# Altium schematic sheet Sheet2.SchDoc
size A4; SheetNumber: 2; SheetTotal: 2
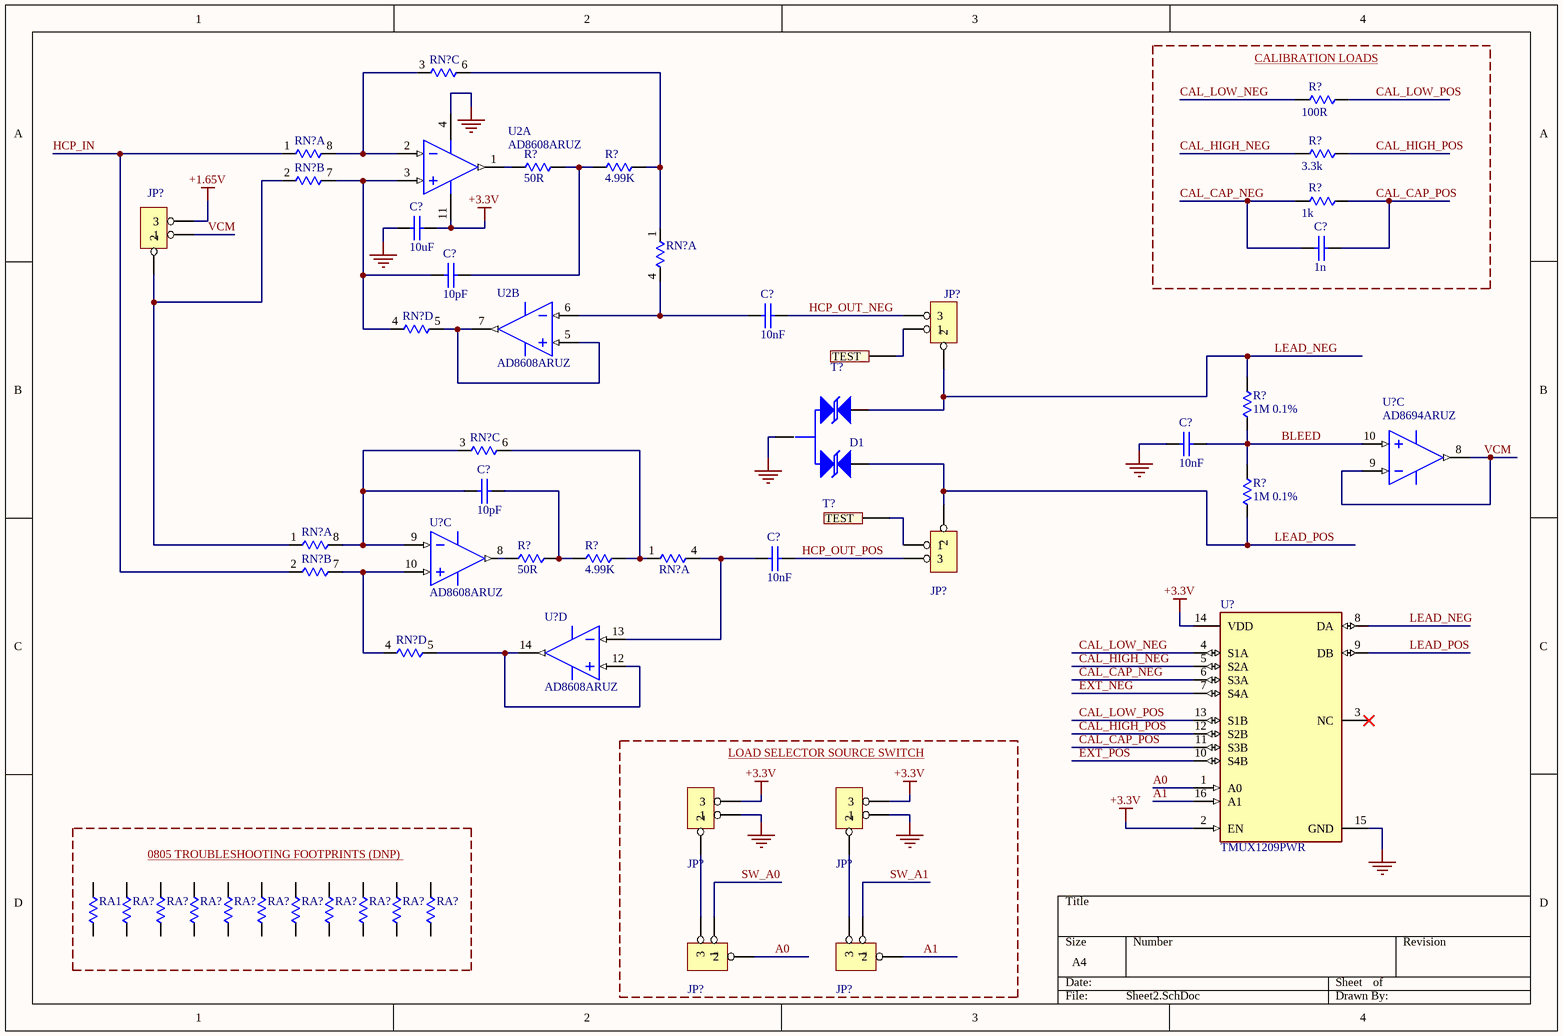
[diagram p0: Sheet2.SchDoc]

## Parts
(Parts that share a designator on the sheet are numbered #1, #2 ... from top to bottom, then left to right.)
C?#1  10uF  [0805-CAP]
C?#2  1n  [0805-CAP]
C?#3  10pF  [0603-CAP]
C?#4  10nF  [0603-CAP]
C?#5  10nF  [0603-CAP]
C?#6  10pF  [0603-CAP]
C?#7  10nF  [0603-CAP]
D1  RCLAMP04022S.C  [SOT-23 3L]  (value not drawn)
JP?#1  JUMPER1X3  [JUMPER3]  (value not drawn)
JP?#2  JUMPER1X3  [JUMPER3]  (value not drawn)
JP?#3  JUMPER1X3  [JUMPER3]  (value not drawn)
JP?#4  JUMPER1X3  [JUMPER3]  (value not drawn)
JP?#5  JUMPER1X3  [JUMPER3]  (value not drawn)
JP?#6  JUMPER1X3  [JUMPER3]  (value not drawn)
JP?#7  JUMPER1X3  [JUMPER3]  (value not drawn)
R?#1  100R  [0805-RES]
R?#2  3.3k  [0805-RES]
R?#3  50R  [0603-RES]
R?#4  4.99K  [0603-RES]
R?#5  1k  [0805-RES]
R?#6  1M 0.1%  [0805-RES]  (no BOM)
R?#7  1M 0.1%  [0805-RES]  (no BOM)
R?#8  50R  [0603-RES]
R?#9  4.99K  [0603-RES]
RA1  240R 0.1%  [0805-RES]  (value not drawn)  (no BOM)
RA?#1  240R 0.1%  [0805-RES]  (value not drawn)  (no BOM)
RA?#2  240R 0.1%  [0805-RES]  (value not drawn)  (no BOM)
RA?#3  240R 0.1%  [0805-RES]  (value not drawn)  (no BOM)
RA?#4  240R 0.1%  [0805-RES]  (value not drawn)  (no BOM)
RA?#5  240R 0.1%  [0805-RES]  (value not drawn)  (no BOM)
RA?#6  240R 0.1%  [0805-RES]  (value not drawn)  (no BOM)
RA?#7  240R 0.1%  [0805-RES]  (value not drawn)  (no BOM)
RA?#8  240R 0.1%  [0805-RES]  (value not drawn)  (no BOM)
RA?#9  240R 0.1%  [0805-RES]  (value not drawn)  (no BOM)
RA?#10  240R 0.1%  [0805-RES]  (value not drawn)  (no BOM)
RN?#1  ACASA1002S1002P1AT  [1206 4-Resistor Network]  (value not drawn)  (part C of 4)
RN?#2  ACASA1002S1002P1AT  [1206 4-Resistor Network]  (value not drawn)  (part A of 4)
RN?#3  ACASA1002S1002P1AT  [1206 4-Resistor Network]  (value not drawn)  (part B of 4)
RN?#4  ACASN1002S1002P1AT  [0606 2-RESISTOR NETWORK]  (value not drawn)  (part A of 2)
RN?#5  ACASA1002S1002P1AT  [1206 4-Resistor Network]  (value not drawn)  (part D of 4)
RN?#6  ACASA1002S1002P1AT  [1206 4-Resistor Network]  (value not drawn)  (part C of 4)
RN?#7  ACASA1002S1002P1AT  [1206 4-Resistor Network]  (value not drawn)  (part A of 4)
RN?#8  ACASN1002S1002P1AT  [0606 2-RESISTOR NETWORK]  (value not drawn)  (part A of 2)
RN?#9  ACASA1002S1002P1AT  [1206 4-Resistor Network]  (value not drawn)  (part B of 4)
RN?#10  ACASA1002S1002P1AT  [1206 4-Resistor Network]  (value not drawn)  (part D of 4)
T?#1  5011K  [TESTPOINT Black]  (value not drawn)
T?#2  5011K  [TESTPOINT Black]  (value not drawn)
U2  AD8608ARUZ  [ADI-RU-14_L]  (parts A,B of 4)
U?#1  AD8694ARUZ  [ADI-RU-14_L]  (part C of 4)
U?#2  AD8608ARUZ  [ADI-RU-14_L]  (part C of 4)
U?#3  AD8608ARUZ  [ADI-RU-14_L]  (part D of 4)
U?#4  TMUX1209PWR  [FP-PW0016A-MFG]

## Blocks framed on the sheet
CALIBRATION LOADS: C?#2 R?#1 R?#2 R?#5
LOAD SELECTOR SOURCE SWITCH: JP?#4-JP?#7
0805 TROUBLESHOOTING FOOTPRINTS (DNP): RA1 RA?#1-RA?#10

## Nets
+1.65V: JP?#1.3
+3.3V: C?#1.1 JP?#4.3 JP?#5.3 U2.11(-V) U?#4.2(EN) U?#4.14(VDD)
GND: C?#1.2 C?#5.1 D1.3 JP?#4.1 JP?#5.1 U2.4(+V) U?#4.15(GND)
A0: JP?#6.2 U?#4.1(A0)
A1: JP?#7.2 U?#4.16(A1)
BLEED: C?#5.2 R?#6.1 R?#7.2 U?#1.10(+IN_C)
CAL_CAP_NEG: C?#2.1 R?#5.2 U?#4.6(S3A)
CAL_CAP_POS: C?#2.2 R?#5.1 U?#4.11(S3B)
CAL_HIGH_NEG: R?#2.2 U?#4.5(S2A)
CAL_HIGH_POS: R?#2.1 U?#4.12(S2B)
CAL_LOW_NEG: R?#1.2 U?#4.4(S1A)
CAL_LOW_POS: R?#1.1 U?#4.13(S1B)
EXT_NEG: U?#4.7(S4A)
EXT_POS: U?#4.10(S4B)
HCP_IN: RN?#2.1 RN?#9.2
HCP_OUT_NEG: C?#4.2 JP?#2.3
HCP_OUT_POS: C?#7.2 JP?#3.3
LEAD_NEG: D1.2 JP?#2.2 R?#6.2 U?#4.8(DA)
LEAD_POS: D1.1 JP?#3.2 R?#7.1 U?#4.9(DB)
SW_A0: JP?#6.1
SW_A1: JP?#7.1
VCM: JP?#1.1 U?#1.8(OUT_C) U?#1.9(-IN_C)
NetC?#3_1: C?#3.1 RN?#3.7 RN?#5.4 U2.3(+IN_A)
NetC?#3_2: C?#3.2 R?#3.2 R?#4.1
NetC?#4_1: C?#4.1 RN?#4.4 U2.6(-IN_B)
NetC?#6_1: C?#6.1 RN?#6.3 RN?#7.8 U?#2.9(-IN_C)
NetC?#6_2: C?#6.2 R?#8.2 R?#9.1
NetC?#7_1: C?#7.1 RN?#8.4 U?#3.13(-IN_D)
NetJP?#1_2: JP?#1.2 RN?#3.2 RN?#7.1
NetJP?#2_1: JP?#2.1 T?#1.1(TEST)
NetJP?#3_1: JP?#3.1 T?#2.1(TEST)
NetJP?#4_2: JP?#4.2 JP?#6.3
NetJP?#5_2: JP?#5.2 JP?#7.3
NetR?#3_1: R?#3.1 U2.1(OUT_A)
NetR?#4_2: R?#4.2 RN?#1.6 RN?#4.1
NetR?#9_2: R?#9.2 RN?#6.6 RN?#8.1
NetRN?#1_3: RN?#1.3 RN?#2.8 U2.2(-IN_A)
NetRN?#5_5: RN?#5.5 U2.5(+IN_B) U2.7(OUT_B)
NetRN?#9_7: RN?#9.7 RN?#10.4 U?#2.10(+IN_C)
NetRN?#10_5: RN?#10.5 U?#3.12(+IN_D) U?#3.14(OUT_D)

Not connected (* = marked no-connect by the designer): R?#8 1; RA1 1 2; RA?#1 1 2; RA?#2 1 2; RA?#3 1 2; RA?#4 1 2; RA?#5 1 2; RA?#6 1 2; RA?#7 1 2; RA?#8 1 2; RA?#9 1 2; RA?#10 1 2; U?#2 8(OUT_C); U?#4 3(NC)*

## Library data of the parts
C?#1 = CL21B104KCFNNNE: CAP CER 10UF 100V X7R 0805; Manufacturer 1: Samsung; Detailed Description: CAP CER 0.1UF 100V X7R 0805; Tech#: SMT; Manufacturer Part Number 1: CL21B104KCFNNNE; Supplier 1: DigiKey; Supplier Part Number 1: 1276-6840-1-ND; Supplier 2: Mouser; Supplier Part Number 2: 791-0603B104K101CT; Price(100): 0.019
C?#2 = CL21B104KCFNNNE: CAP CER 100pF C0G 0805; Manufacturer 1: Samsung; Detailed Description: CAP CER 0.1UF 100V X7R 0805; Tech#: SMT; Manufacturer Part Number 1: CL21B104KCFNNNE; Supplier 1: DigiKey; Supplier Part Number 1: 1276-6840-1-ND; Supplier 2: Mouser; Supplier Part Number 2: 791-0603B104K101CT; Price(100): 0.019
C?#3-C?#7 = CGA3E2C0G1H472J080AA: CAP CER 4700PF 50V C0G 0603; Manufacturer 1: TDK Corporation; Tech#: SMT; Manufacturer Part Number 1: CGA3E2C0G1H472J080AA; Detailed Description: CAP CER 4700PF 50V C0G 0603; Supplier 1: DigiKey; Supplier Part Number 1: 445-6912-1-ND; Supplier 2: Mouser; Supplier Part Number 2: 810-CGA3E2C0G1H472J; Price(100): 0.1434; Price(250): 0.10756
JP?#1-JP?#7 = 68001-203HLF: CONN HEADER VERT 36POS 2.54MM; Manufacturer 1: FCI; Detailed Description: Jumper, 1x3 Vertical T/H 0.1in; Location: #N/A; Notes: Can be 68001-236HLF cut to length; Tech#: T/H; Manufacturer Part Number 1: 68001-203HLF; Supplier 1: DigiKey; Supplier Part Number 1: 609-3470-ND; Supplier 2: Mouser; Supplier Part Number 2: 649-68001-203HLF; Price(1): 0.43; Price(10): 0.32; Price(25): 0.32; Price(100): 0.2436
R?#1 = 240R 0.1%: RES SMD 100 OHM 0.1% 1/8W 0805; Manufacturer Part Number 1: RG2012P-241-B-T5; Manufacturer 1: Susumu; Detailed Description: RES SMD 240 OHM 0.1% 1/8W 0805; Tech#: SMT; Supplier 1: Mouser; Supplier Part Number 1: 754-RG2012P-241-BT5; Supplier 2: DigiKey; Supplier Part Number 2: RG20P240BCT-ND; Price(100): 0.149
R?#2 = 240R 0.1%: RES SMD 3.3k OHM 0.1% 1/8W 0805; Manufacturer Part Number 1: RG2012P-241-B-T5; Manufacturer 1: Susumu; Detailed Description: RES SMD 240 OHM 0.1% 1/8W 0805; Tech#: SMT; Supplier 1: Mouser; Supplier Part Number 1: 754-RG2012P-241-BT5; Supplier 2: DigiKey; Supplier Part Number 2: RG20P240BCT-ND; Price(100): 0.149
R?#3 R?#8 = 4.99K 0603: RES SMD 50OHM 0.5% 1/16W 0603; Manufacturer Part Number 1: RR0816P-4991-D-68H; Manufacturer 1: Susumu; Detailed Description: RES SMD 4.99KOHM 0.5% 1/16W 0603; Tech#: SMT; Supplier 1: DigiKey; Supplier Part Number 1: RR08P4.99KDCT-ND; Supplier 2: Mouser; Supplier Part Number 2: 754-RR0816P-4991D68H; Price(100): 0.023
R?#4 R?#9 = 4.99K 0603: RES SMD 4.99KOHM 0.5% 1/16W 0603; Manufacturer Part Number 1: RR0816P-4991-D-68H; Manufacturer 1: Susumu; Tech#: SMT; Detailed Description: RES SMD 4.99KOHM 0.5% 1/16W 0603; Supplier 1: DigiKey; Supplier Part Number 1: RR08P4.99KDCT-ND; Supplier 2: Mouser; Supplier Part Number 2: 754-RR0816P-4991D68H; Price(100): 0.023
R?#5 = 240R 0.1%: RES SMD 1kOHM 0.1% 1/8W 0805; Manufacturer Part Number 1: RG2012P-241-B-T5; Manufacturer 1: Susumu; Detailed Description: RES SMD 240 OHM 0.1% 1/8W 0805; Tech#: SMT; Supplier 1: Mouser; Supplier Part Number 1: 754-RG2012P-241-BT5; Supplier 2: DigiKey; Supplier Part Number 2: RG20P240BCT-ND; Price(100): 0.149
R?#6 R?#7 = 240R 0.1%: Manufacturer Part Number 1: RG2012P-241-B-T5; Manufacturer 1: Susumu; Detailed Description: RES SMD 240 OHM 0.1% 1/8W 0805; Tech#: SMT; Supplier 1: Mouser; Supplier Part Number 1: 754-RG2012P-241-BT5; Supplier 2: DigiKey; Supplier Part Number 2: RG20P240BCT-ND; Price(100): 0.149
RA1 RA?#1-RA?#10 = 240R 0.1%: RES SMD 240 OHM 0.1% 1/8W 0805; Manufacturer Part Number 1: RG2012P-241-B-T5; Manufacturer 1: Susumu; Tech#: SMT; Detailed Description: RES SMD 240 OHM 0.1% 1/8W 0805; Supplier 1: Mouser; Supplier Part Number 1: 754-RG2012P-241-BT5; Supplier 2: DigiKey; Supplier Part Number 2: RG20P240BCT-ND; Price(100): 0.149
RN?#1-RN?#3 RN?#5-RN?#7 RN?#9 RN?#10 = ACASA1002S1002P1AT: 4 resistor, resistor network in a 8 pin DIP package
RN?#4 RN?#8 = ACASN1002S1002P1AT: 2 resistor, resistor network, 10k/10k 0.1% abs. and 0.05% rel., 0606, 25ppm
T?#1 T?#2 = 5011K: PC TEST POINT MULTIPURPOSE BLACK; Manufacturer 1: Keystone Electronics; Detailed Description: Connector, TestPoint Black; Location: F1-34; Tech#: T/H; Manufacturer Part Number 1: 5011K; Supplier 1: DigiKey; Supplier Part Number 1: 36-5011-ND; Supplier 2: Mouser; Supplier Part Number 2: 534-5011; Price(1): 0.57; Price(10): 0.506; Price(100): 0.3541
U2 U?#2 U?#3 = CMP-0384-01824-2: Quad Channel Wide Bandwidth Operational Amplifier, 10 MHz BW, 5 V/us SR, Industrial, 14-pin SOP (RU-14), Tube; Manufacturer: Analog Devices; Generic Part Number: AD8608; Iq/Amp: 1.2mA; Slew Rate: 5V/us; V Span Max: 6V; Small Signal Bandwidth: 10MHz; Amplifiers Per Package: 4; Input Bias Current: 200fA; V Span Min: 2.7V; Input Offset Voltage: 20uV; ComponentLink1Description: Manufacturer URL; DatasheetVersion: Rev. L; ComponentLink3URL: http://www.analog.com/static/imported-files/packages/36057385283879153717235186773RU14.pdf; ComponentLink1URL: http://www.analog.com/en/index.html; Mounting Technology: Surface Mount; ComponentLink3Description: Package Specification; PackageDescription: 14-Pin Thin Shrink Small Outline Package, Body 5 x 4.4 mm, Pitch 0.65 mm; PackageReference: RU-14; ComponentLink4URL: http://www.analog.com/en/all-operational-amplifiers-op-amps/operational-amplifiers-op-amps/ad8608/products/product.html#product-recommendations; PartNumber: AD8608ARUZ; RevisionNote: Reference Circuit URL fixed; Code_JEDEC: MO-153AB-1; ComponentLink4Description: Reference Circuit; ComponentLink2Description: Datasheet; ComponentLink2URL: http://www.analog.com/static/imported-files/data_sheets/AD8605_8606_8608.pdf
U?#1 = CMP-0384-01915-1: Quad Channel Wide Bandwidth Operational Amplifier, 10 MHz BW, 5 V/us SR, Industrial, 14-pin SOP (RU-14), Tube; Manufacturer: Analog Devices; Generic Part Number: AD8694; Input Bias Current: 200fA; Amplifiers Per Package: 4; Automotive Qualified: Yes; V Span Max: 6V; V Span Min: 2.7V; Iq/Amp: 1.2mA; Slew Rate: 5V/us; Small Signal Bandwidth: 10MHz; Input Offset Voltage: 400uV; PackageReference: RU-14; ComponentLink3URL: http://www.analog.com/static/imported-files/packages/36057385283879153717235186773RU14.pdf; ComponentLink3Description: Package Specification; Mounting Technology: Surface Mount; PackageDescription: 14-Pin Thin Shrink Small Outline Package, Body 5 x 4.4 mm, Pitch 0.65 mm; DatasheetVersion: Rev. E; Code_JEDEC: MO-153AB-1; ComponentLink1Description: Manufacturer URL; ComponentLink2URL: http://www.analog.com/static/imported-files/data_sheets/AD8691_8692_8694.pdf; ComponentLink2Description: Datasheet; ComponentLink1URL: http://www.analog.com/en/index.html; PartNumber: AD8694ARUZ
U?#4 = CMP-04892-000106-1: IC SWITCH DUAL 16TSSOP